# Altium schematic sheet E.M BOX.SchDoc
size A4; SheetNumber: 5; SheetTotal: 6
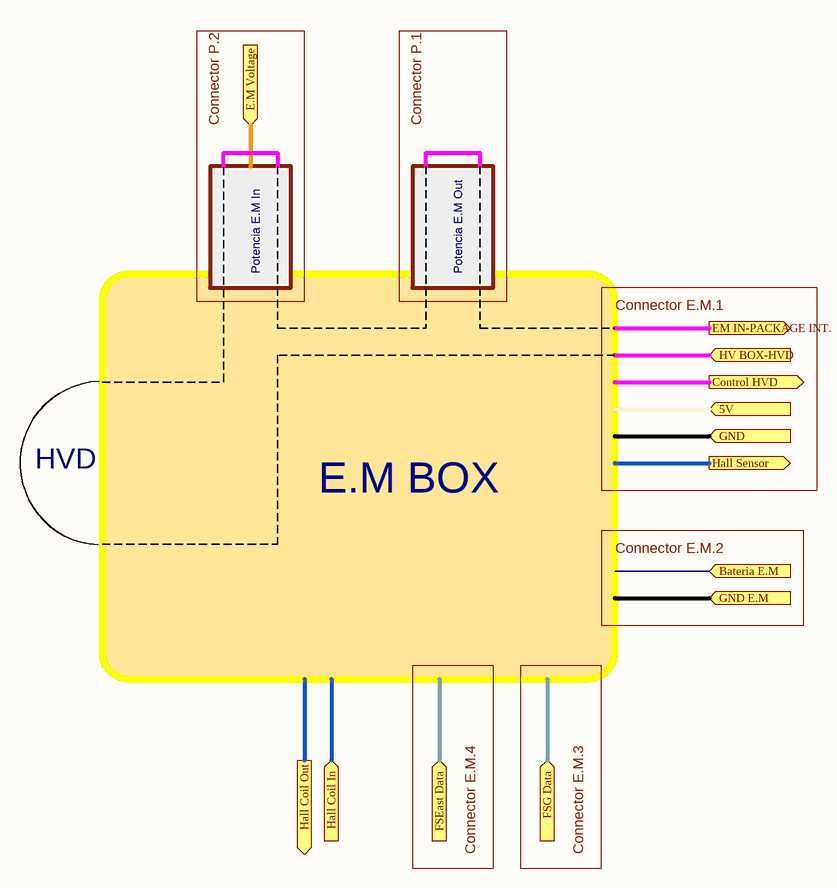
[diagram p0: E.M BOX.SchDoc]

## Ports
5V (in), Bateria E.M (in), Control HVD (out), E.M Voltage (in), EM IN-PACKAGE INT. (out), FSEast Data (in), FSG Data (in), GND (in), GND E.M (in), Hall Coil In (in), Hall Coil Out (out), Hall Sensor (out), HV BOX-HVD (in)

## Notes on the sheet
- Connector P.2
- Connector P.1
- Potencia E.M In
- Potencia E.M Out
- Connector E.M.1
- HVD
- E.M BOX
- Connector E.M.2
- Connector E.M.4
- Connector E.M.3